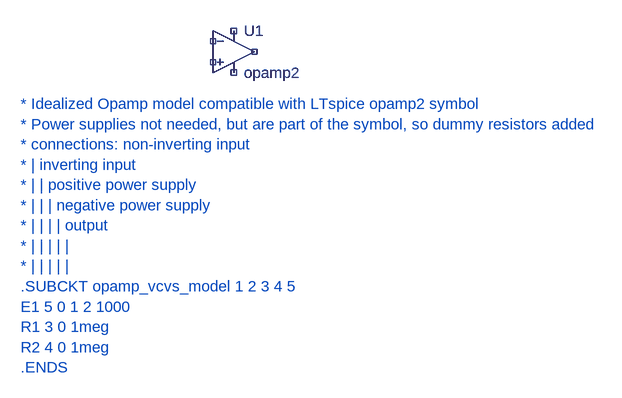
[diagram p0: schematic Draft10.asc]
Draft10.asc, the LTspice schematic file:
Version 4
SHEET 1 1000 700
SYMBOL OpAmps/opamp2 432 256 R0
SYMATTR InstName U1
TEXT 104 400 Left 2 ;* Idealized Opamp model compatible with LTspice opamp2 symbol\n* Power supplies not needed, but are part of the symbol, so dummy resistors added\n* connections: non-inverting input\n* | inverting input\n* | | positive power supply\n* | | | negative power supply\n* | | | | output\n* | | | | |\n* | | | | |\n.SUBCKT opamp_vcvs_model 1 2 3 4 5\nE1 5 0 1 2 1000\nR1 3 0 1meg\nR2 4 0 1meg\n.ENDS

The netlist it stands for:
* Draft10.asc
XU1 NC_01 NC_02 NC_03 NC_04 NC_05 opamp2  ; pins In+ In- V+ V- OUT
* * Idealized Opamp model compatible with LTspice opamp2 symbol
* * Power supplies not needed, but are part of the symbol, so dummy resistors added
* * connections: non-inverting input
* * | inverting input
* * | | positive power supply
* * | | | negative power supply
* * | | | | output
* * | | | | |
* * | | | | |
* .SUBCKT opamp_vcvs_model 1 2 3 4 5
* E1 5 0 1 2 1000
* R1 3 0 1meg
* R2 4 0 1meg
* .ENDS
.backanno
.end